# EAGLE design cc2652r_v2_rs (EAGLE 9.6.2)
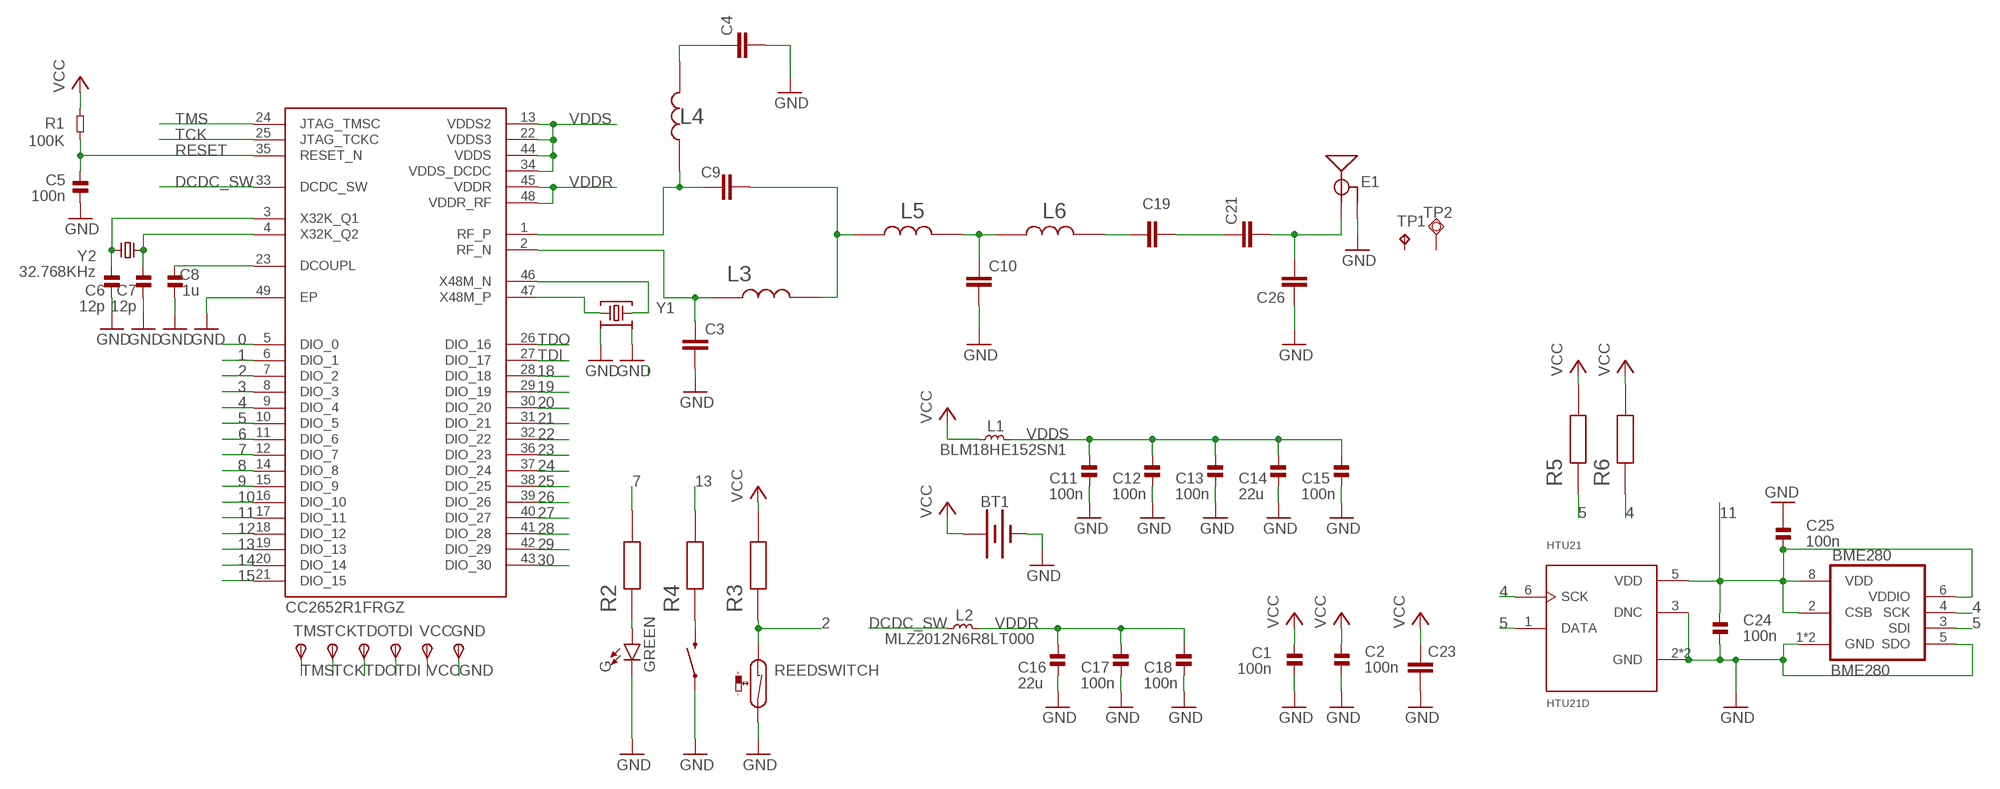
[diagram p0: schematic, sheet 1]

## Parts
BME280  BME280  [BME280]
BT1  BATTERY-20MM_SMD  [BATTCON_20MM]
C1  100n  CAP-0402  [_PKG_C_0402]
C2  100n  CAP-0402  [_PKG_C_0402]
C3  CAP0402  [CAPC1005X40N]
C4  12pF  CAP0402  [CAPC1005X40N]
C5  100n  CAP-0402  [_PKG_C_0402]
C6  12p  CAP-0402  [_PKG_C_0402]
C7  12p  CAP-0402  [_PKG_C_0402]
C8  1u  CAP-0402  [_PKG_C_0402]
C9  1pF  CAP0402  [CAPC1005X40N]
C10  1pF  CAP0402  [CAPC1005X40N]
C11  100n  CAP-0402  [_PKG_C_0402]
C12  100n  CAP-0402  [_PKG_C_0402]
C13  100n  CAP-0402  [_PKG_C_0402]
C14  22u  CAP-0805  [_PKG_C_0805]
C15  100n  CAP-0402  [_PKG_C_0402]
C16  22u  CAP-0805  [_PKG_C_0805]
C17  100n  CAP-0402  [_PKG_C_0402]
C18  100n  CAP-0402  [_PKG_C_0402]
C19  12pF  CAP0402  [CAPC1005X40N]
C21  1.8pF  CAP0402  [CAPC1005X40N]
C23  C_TANTALUM-2917(7343-METRIC)  [CAPM7343X310]
C24  100n  CAP-0402  [_PKG_C_0402]
C25  100n  CAP-0402  [_PKG_C_0402]
C26  CAP0402  [CAPC1005X40N]
E1  ANTENNA-GROUNDEDTRACE-15.2MM  [TRACE_ANTENNA_2.4GHZ_15.2MM]
G  GREEN  LED-GREEN0603  [LED-0603]
GND  TPSTP11R  [TP11R]
HTU21  HTU21D  [QFN100P300X300X100-7N]
IC3  CC2652R1FRGZ  CC2652R1FRGZT  [QFN50P700X700X100-49N]
L1  BLM18HE152SN1  INDUCTOR-0603  [_PKG_L_0603]
L2  MLZ2012N6R8LT000  INDUCTOR-0805  [_PKG_C_0805]
L3  2.4nH  IND0402IND0402  [INDC1005X40N]
L4  2.4nH  IND0402IND0402  [INDC1005X40N]
L5  2nH  IND0402IND0402  [INDC1005X40N]
L6  2nH  IND0402IND0402  [INDC1005X40N]
R1  100K  RES-0402  [_PKG_C_0402]
R2  2.2k  RES0402  [RESC1005X40N]
R3  510k  RES0402  [RESC1005X40N]
R4  100Ohm  RES0402  [RESC1005X40N]
R5  10k  RES0402  [RESC1005X40N]
R6  10k  RES0402  [RESC1005X40N]
REEDSWITCH  REED-SWITCH-MK6-5-B  [MK6-5]
SW1  MOMENTARY-SWITCH-SPST-SMD-4.6X2.8MM  [TACTILE_SWITCH_SMD_4.6X2.8MM]
TCK  TPSTP11R  [TP11R]
TDI  TPSTP11R  [TP11R]
TDO  TPSTP11R  [TP11R]
TMS  TPSTP11R  [TP11R]
TP1  TPTP06SQ  [TP05SQ]
TP2  TPSQTP15SQ  [TP15SQ]
VCC  TPSTP11R  [TP11R]
Y1  Q22FA12800150  48.000MHZ_CX2016DB48000C0FPLC1  [XTAL-4P-2016]
Y2  32.768KHz  32.768KHZ_Q13FC1350000400  [XTAL-2P-3215]

## Nets
0: IC3.5(DIO_0)
1: IC3.6(DIO_1)
2: IC3.7(DIO_2) R3.1 REEDSWITCH.1
3: IC3.8(DIO_3)
4: BME280.4(SCK) HTU21.6(SCK) IC3.9(DIO_4) R6.1
5: BME280.3(SDI) HTU21.1(DATA) IC3.10(DIO_5) R5.1
6: IC3.11(DIO_6)
7: IC3.12(DIO_7) R2.2
8: IC3.14(DIO_8)
9: IC3.15(DIO_9)
10: IC3.16(DIO_10)
11: BME280.2(CSB) BME280.6(VDDIO) BME280.8(VDD) C24.2 C25.1 HTU21.5(VDD) IC3.17(DIO_11)
12: IC3.18(DIO_12)
13: IC3.19(DIO_13) R4.2
14: IC3.20(DIO_14)
15: IC3.21(DIO_15)
18: IC3.28(DIO_18)
19: IC3.29(DIO_19)
20: IC3.30(DIO_20)
21: IC3.31(DIO_21)
22: IC3.32(DIO_22)
23: IC3.36(DIO_23)
24: IC3.37(DIO_24)
25: IC3.38(DIO_25)
26: IC3.39(DIO_26)
27: IC3.40(DIO_27)
28: IC3.41(DIO_28)
29: IC3.42(DIO_29)
30: IC3.43(DIO_30)
DCDC_SW: IC3.33(DCDC_SW) L2.1
DCOUPL: C8.2 IC3.23(DCOUPL)
GND: BME280.1(GND) BME280.5(SDO) BME280.7(GND) BT1.2(-) C1.1 C2.1 C3.2 C4.2 C5.1 C6.1 C7.1 C8.1 C10.2 C11.2 C12.2 C13.2 C14.2 C15.2 C16.2 C17.2 C18.2 C23.2 C24.1 C25.2 C26.1 E1.GND G.C GND.TP(PP) HTU21.2(GND) HTU21.3(DNC) HTU21.PAD(GND) IC3.49(EP) REEDSWITCH.2 SW1.1 SW1.2 Y1.2 Y1.4
N$1: C9.1 IC3.1(RF_P) L4.1
N$2: C3.1 IC3.2(RF_N) L3.1
N$3: C4.1 L4.2
N$4: C9.2 L3.2 L5.1
N$5: C19.1 L6.2
N$6: R4.1 SW1.3 SW1.4
N$7: C19.2 C21.1
N$9: C21.2 C26.2 E1.ANT(SIGNAL)
N$10: C10.1 L5.2 L6.1
N$11: G.A R2.1
RESET: C5.2 IC3.35(RESET_N) R1.1
TCK: IC3.25(JTAG_TCKC) TCK.TP(PP)
TDI: IC3.27(DIO_17) TDI.TP(PP)
TDO: IC3.26(DIO_16) TDO.TP(PP)
TMS: IC3.24(JTAG_TMSC) TMS.TP(PP)
VCC: BT1.1(+) C1.2 C2.2 C23.1 L1.1 R1.2 R3.2 R5.2 R6.2 VCC.TP(PP)
VDDR: C16.1 C17.1 C18.1 IC3.45(VDDR) IC3.48(VDDR_RF) L2.2
VDDS: C11.1 C12.1 C13.1 C14.1 C15.1 IC3.13(VDDS2) IC3.22(VDDS3) IC3.34(VDDS_DCDC) IC3.44(VDDS) L1.2
X32K_Q1: C6.2 IC3.3(X32K_Q1) Y2.1
X32K_Q2: C7.2 IC3.4(X32K_Q2) Y2.2
X48M_N: IC3.46(X48M_N) Y1.3
X48M_P: IC3.47(X48M_P) Y1.1
Unconnected: TP1.TP TP2.TP

## Library data of the parts
BME280 = bosch-bme280:BME280: DIGITAL HUMIDITY, PRESSURE AND TEMPERATURE SENSOR * Digital interface I²C (up to 3.4 MHz) and SPI (3 and 4 wire, up to 10 MHz)* Supply voltage VDD main supply voltage range: 1.71 V to 3.6 V*VDDIO interface voltage range: 1.2 V to 3.6 V Operating range -40…+85 °C, 0…100 % rel. humidity, 300…1100 hPa The library has been designed by Richard Magdycz <https://www.facebook.com/groups/eaglecadsoftUK>
BT1 = Batteries:BATTERY: Battery - Single Cell A variety of battery chemistries, sizes, and footprints. Device List: 20MM_PTH - Coin Cell Battery Holder - 20mm (PTH) <https://www.sparkfun.com/products/783> 6.8MM_PTH - Coin Cell Battery Holder - 6.8MM(SMD) <https://www.digikey.com/product-detail/en/seiko-instruments/MS621FE-FL11E/728-1057-ND/1889208?WT.srch=1&gclid=CNOQ5a6LzdQCFZS2wAodXCkE0g> 12MM_SMD - Coin Cell Battery Holder - 12mm (SMD) <https://www.sparkfun.com/products/10592> 12MM_PTH - Coin Cell Battery Holder - 12mm (PTH) <https://www.sparkfun.com/products/7948> 20MM_SMD - 20mm Coin Cell Battery Holder (SMD) (2 legs) Used on the Big Time Watch Kit <https://www.sparkfun.com/products/11734> 20MM_SMD_4LEGS - Coin Cell Battery Holder - 20mm (SMD) <https://www.sparkfun.com/products/11892> 20MM_SMD_4LEGS_OVERPASTE - Coin Cell Battery Holder - 20mm (SMD) <https://www.sparkfun.com/products/11892> (Over-paste on the legs) 24.5MM_PTH - Coin Cell Battery Holder - 24.5mm (PTH) <https://www.sparkfun.com/products/8863> 9V - 9V Battery Holder - PC Mount Used on the SparkFun SparkPunk Sound Kit <https://www.sparkfun.com/products/11177> and SparkFun SparkPunk Sequencer Kit <https://www.sparkfun.com/products/12707> 18650 - Battery Holder - 18650 (PTH) <https://www.sparkfun.com/products/13113> AA - Battery Holder - 1xAA (PTH) <https://www.sparkfun.com/products/7949> AAA - Battery Holder - 1xAAA (PTH) <https://www.sparkfun.com/products/12718> AA_KIT - Battery Holder - 1xAA (PTH) <https://www.sparkfun.com/products/7949> Special kit package - pads only have exposed copper on one side of the board. AAA_KIT - Battery Holder - 1xAAA (PTH) <https://www.sparkfun.com/products/12718> Special kit package - pads only have exposed copper on one side of the board.; PROD_ID: BATT-11519
C1 C2 C5-C8 C11-C18 C24 C25 = ok-discretes-dev:CAP
C3 C4 C9 C10 C19 C21 C26 = discretes-dev:CAP0402: CAP, 0402; AVAILABILITY: Good; DESCRIPTION: RESISTOR, 0402 0.063W 1% 3M6; Resistance:3.6Mohm; Resistance Tolerance:± 1%; Power Rating:0.063W; Voltage Rating:50V; Series:RC32H; Temperature Coefficient:± 100ppm/°C; Resistor Element Type:Thick Film; Resistor Case Style:0402; No. of Pins:2; SVHC:No SVHC; Case Style:0402; External Length / Height:1mm; Temperature Coeff. +:100ppm/°C; Temperature Coeff. -:100ppm/°C; External Depth:0.35mm; External Width:0.5mm; Operating Temperature Range:-55°C to +155°C; Overload Voltage:100V; MF: Yageo; MP: RC0402FR-073M6L; PACKAGE: 1005 Panasonic Electronic Components; PRICE: None; PURCHASE-URL: https://pricing.snapeda.com/search/part/RC0402FR-073M6L/?ref=eda
C23 = Capacitor:C: Capacitor - Generic; CATEGORY: Capacitor
E1 = SparkFun-RF:ANTENNA-GROUNDED: Antenna w/ Ground Connection 2.4GHz antennae with signal and ground terminals. TRACE_ANTENNA_2.4GHZ_15.2MM - Meander Trace antenna 15.2 x 5.7mm footprint Based on layout from TI app note AN043 <http://www.ti.com/lit/an/swra117d/swra117d.pdf>. TRACE_ANTENNA_2.4GHZ_25.7MM - Inverted F trace antenna 25.7 x 7.5 mm footprint. Based on layout from TI design note DN0007 <http://www.ti.com/lit/an/swru120b/swru120b.pdf>.
G = SparkFun-LED:LED-GREEN: Green SMD LED Used in manufacturing of various products at SparkFun Packages: 0603 - SMD 0603 package [Product Link] <http://www.futureelectronics.com/en/technologies/semiconductors/optoelectronics/leds/Pages/9894312-LTST-C190GKT.aspx?CrossPart=HSMG-C190&IM=0> LilyPad 1206 - SMD1206 LilyPad package [Product Link] <http://www.futureelectronics.com/en/Technologies/Product.aspx?ProductID=IN150NGHARVATEKCORPORATION2049943&IM=0> 1206 - SMD1206 package [Product Link] <http://www.futureelectronics.com/en/technologies/semiconductors/optoelectronics/leds/Pages/8315665-LTST-C150KGKT.aspx?IM=0> 1206 Bottom Mount -SMD 1206 Bottom Mount [Product Link] <http://www.digikey.com/product-detail/en/lite-on-inc/LTST-C230KGKT/160-1456-1-ND/386854> SparkFun Products: Pro Mini 328 -5V <https://www.sparkfun.com/products/821> RedBoard <https://www.sparkfun.com/products/12757> MP3 Trigger <https://www.sparkfun.com/products/13720> Makey Makey <https://www.sparkfun.com/products/11076>; PROD_ID: DIO-00821
GND TCK TDI TDO TMS VCC = testpad:TPS: TEST PIN
HTU21 = HTU21D:HTU21D: Digital Relative Humidity sensor with Temperature output Check prices <https://pricing.snapeda.com/parts/HTU21D/TE%20Connectivity/view-part?ref=eda>; AVAILABILITY: Warning; COMMENT: CAT-HSC0004; DESCRIPTION: Humidity Temperature Sensor 0 ~ 100% RH I²C ±2% RH 5s Surface Mount; MF: TE Connectivity; MP: HTU21D; PACKAGE: DFN-6 TE Connectivity; PRICE: None; PURCHASE-URL: https://pricing.snapeda.com/search/part/HTU21D/?ref=eda
IC3 = CC2652R1FRGZT:CC2652R1FRGZT: Texas Instruments SimpleLink? Multi-Standard CC2652R Wireless MCU 48-VQFN -40 to 85 Source: Datasheet <http://www.ti.com/lit/ds/symlink/cc2652r.pdf>; ARROW_PART_NUMBER: CC2652R1FRGZT; ARROW_PRICE-STOCK: https://www.arrow.com/en/products/cc2652r1frgzt/texas-instruments; DESCRIPTION: Texas Instruments SimpleLink? Multi-Standard CC2652R Wireless MCU 48-VQFN -40 to 85; HEIGHT: 1mm; MANUFACTURER_NAME: Texas Instruments; MANUFACTURER_PART_NUMBER: CC2652R1FRGZT; MOUSER_PART_NUMBER: 595-CC2652R1FRGZT; MOUSER_PRICE-STOCK: https://www.mouser.co.uk/ProductDetail/Texas-Instruments/CC2652R1FRGZT?qs=rrS6PyfT74ekj88w7n1zLw%3D%3D
L1 L2 = ok-discretes-dev:INDUCTOR
L3-L6 = discretes-dev:IND0402: RESISTOR, 0402 0.063W 1% 3M6; Resistance:3.6Mohm; Resistance Tolerance:± 1%; Power Rating:0.063W; Voltage Rating:50V; Series:RC32H; Temperature Coefficient:± 100ppm/°C; Resistor Element Type:Thick Film; Resistor Case Style:0402; No. of Pins:2; SVHC:No SVHC; Case Style:0402; External Length / Height:1mm; Temperature Coeff. +:100ppm/°C; Temperature Coeff. -:100ppm/°C; External Depth:0.35mm; External Width:0.5mm; Operating Temperature Range:-55°C to +155°C; Overload Voltage:100V Check prices <https://pricing.snapeda.com/parts/RC0402FR-073M6L/Yageo/view-part?ref=eda>; AVAILABILITY: Good; DESCRIPTION: RESISTOR, 0402 0.063W 1% 3M6; Resistance:3.6Mohm; Resistance Tolerance:± 1%; Power Rating:0.063W; Voltage Rating:50V; Series:RC32H; Temperature Coefficient:± 100ppm/°C; Resistor Element Type:Thick Film; Resistor Case Style:0402; No. of Pins:2; SVHC:No SVHC; Case Style:0402; External Length / Height:1mm; Temperature Coeff. +:100ppm/°C; Temperature Coeff. -:100ppm/°C; External Depth:0.35mm; External Width:0.5mm; Operating Temperature Range:-55°C to +155°C; Overload Voltage:100V; MF: Yageo; MP: RC0402FR-073M6L; PACKAGE: 1005 Panasonic Electronic Components; PRICE: None; PURCHASE-URL: https://pricing.snapeda.com/search/part/RC0402FR-073M6L/?ref=eda
R1 = ok-discretes-dev:RES
R2-R6 = discretes-dev:RES0402: RESISTOR, 0402 0.063W 1% 3M6; Resistance:3.6Mohm; Resistance Tolerance:± 1%; Power Rating:0.063W; Voltage Rating:50V; Series:RC32H; Temperature Coefficient:± 100ppm/°C; Resistor Element Type:Thick Film; Resistor Case Style:0402; No. of Pins:2; SVHC:No SVHC; Case Style:0402; External Length / Height:1mm; Temperature Coeff. +:100ppm/°C; Temperature Coeff. -:100ppm/°C; External Depth:0.35mm; External Width:0.5mm; Operating Temperature Range:-55°C to +155°C; Overload Voltage:100V Check prices <https://pricing.snapeda.com/parts/RC0402FR-073M6L/Yageo/view-part?ref=eda>; AVAILABILITY: Good; DESCRIPTION: RESISTOR, 0402 0.063W 1% 3M6; Resistance:3.6Mohm; Resistance Tolerance:± 1%; Power Rating:0.063W; Voltage Rating:50V; Series:RC32H; Temperature Coefficient:± 100ppm/°C; Resistor Element Type:Thick Film; Resistor Case Style:0402; No. of Pins:2; SVHC:No SVHC; Case Style:0402; External Length / Height:1mm; Temperature Coeff. +:100ppm/°C; Temperature Coeff. -:100ppm/°C; External Depth:0.35mm; External Width:0.5mm; Operating Temperature Range:-55°C to +155°C; Overload Voltage:100V; MF: Yageo; MP: RC0402FR-073M6L; PACKAGE: 1005 Panasonic Electronic Components; PRICE: None; PURCHASE-URL: https://pricing.snapeda.com/search/part/RC0402FR-073M6L/?ref=eda
REEDSWITCH = switch-reed:REED-SWITCH-: Reed Sensor; MF: MEDER; MPN: MK6-5-B; OC_FARNELL: 1079479
SW1 = SparkFun-Switches:MOMENTARY-SWITCH-SPST: Momentary Switch (Pushbutton) - SPST Normally-open (NO) SPST momentary switches (buttons, pushbuttons). Variants PTH-12MM - 12mm square, through-hole Momentary Pushbutton Switch - 12mm Square <https://www.sparkfun.com/products/9190> (COM-09190) PTH-6.0MM, PTH-6.0MM-KIT - 6.0mm square, through-hole Mini Pushbutton Switch <https://www.sparkfun.com/products/97> (COM-00097) KIT package intended for soldering kit's - only one side of pads' copper is exposed. PTH-RIGHT-ANGLE-KIT - Right-angle, through-hole Right Angle Tactile Button <https://www.sparkfun.com/products/10791> - Used on SparkFun BigTime Watch Kit <https://www.sparkfun.com/products/11734> SMD-12MM - 12mm square, surface-mount Tactile Button - SMD (12mm) <https://www.sparkfun.com/products/12993> (COM-12993) Used on SparkFun PicoBoard <https://www.sparkfun.com/products/11888> SMD-4.5MM - 4.5mm Square Trackball Switch Used on SparkFun Blackberry Trackballer Breakout <https://www.sparkfun.com/products/13169> SMD-4.6MMX2.8MM - 4.60mm x 2.80mm, surface mount Used on SparkFun SAMD21 Mini Breakout <https://www.sparkfun.com/products/13664> SMD-5.2MM, SMD-5.2-REDUNDANT - 5.2mm square, surface-mount Mini Pushbutton Switch - SMD <https://www.sparkfun.com/products/8720> (COM-08720) Used on Arduino Pro Mini <https://www.sparkfun.com/products/11114> REDUNDANT package connects both switch circuits together SMD-6.0X3.5MM - 6.0 x 3.5mm, surface mount Momentary Reset Switch SMD <https://www.sparkfun.com/products/8229> (COM-08229) SMD-6.2MM-TALL - 6.2mm square, surface mount Tactile Button - SMD (6mm) <https://www.sparkfun.com/products/12992> Used on SparkFun Digital Sandbox <https://www.sparkfun.com/products/12651> SMD-RIGHT-ANGLE - Right-angle, surface mount Used on SparkFun Block for Intel® Edison - Arduino <https://www.sparkfun.com/products/13036>; PROD_ID: SWCH-13065
TP1 = testpad:TP: Test pad
TP2 = testpad:TPSQ: Test pad
Y1 = ok-xtal-osc-dev:48.000MHZ_CX2016DB48000C0FPLC1: 48MHz ±10ppm Crystal 7pF 50 Ohms 4-SMD, No Lead Datasheet <https://media.digikey.com/pdf/Data%20Sheets/Kyocera%20International/CX2016DB48000C0FPLC1_DS.pdf>; DIGIKEY_PART: 1253-2042-1-ND; MFG_NAME: KYOCERA; MFG_PART: CX2016DB48000C0FPLC1
Y2 = ok-xtal-osc-dev:32.768KHZ_Q13FC1350000400: SMD Crystal Resonators 32.768KHz +/-20ppm SMD-3215_2P RoHS Datasheet <https://datasheet.lcsc.com/szlcsc/1901081604_Seiko-Epson-Q13FC1350000400_C32346.pdf>; LCSC_PART: C32346; MFG_NAME: SEIKO EPSON; MFG_PART: Q13FC1350000400

## Board
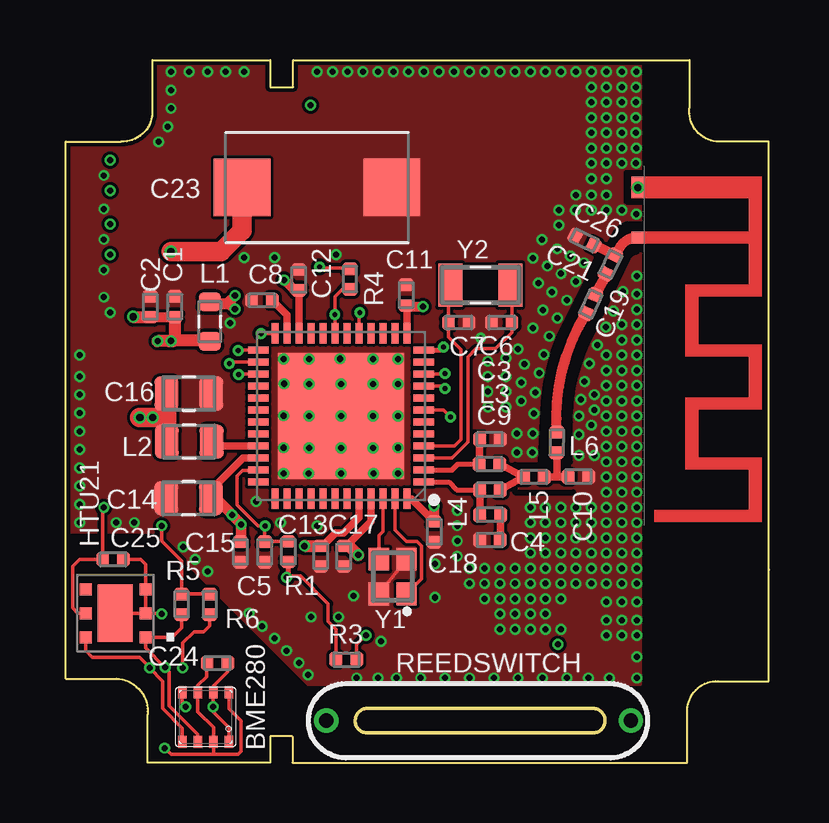
[diagram p1: board, top side]
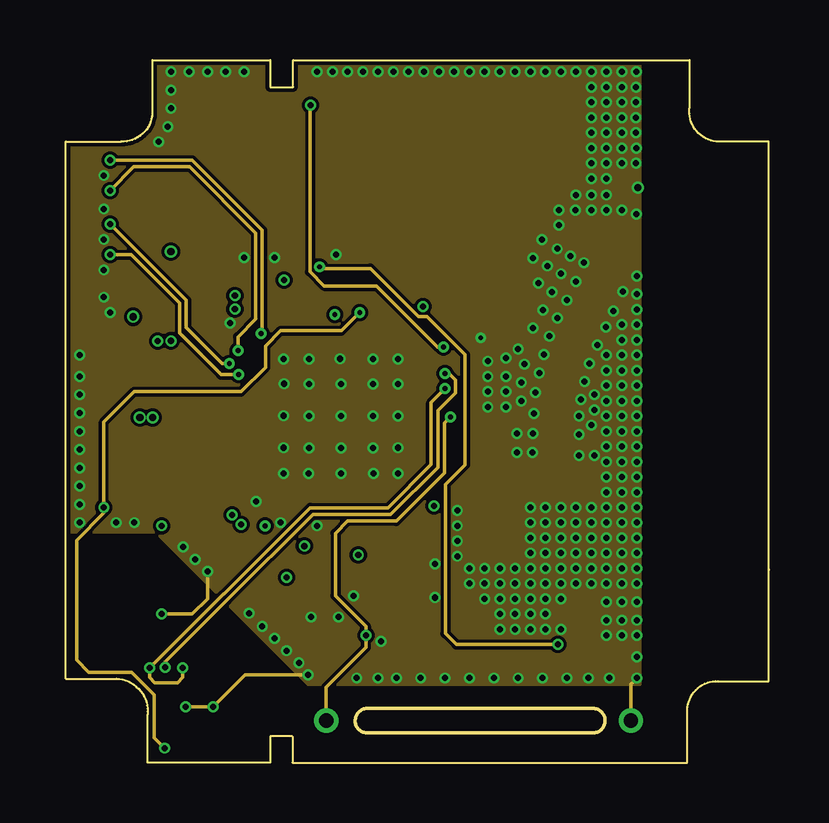
[diagram p2: board, inner layer Route2]
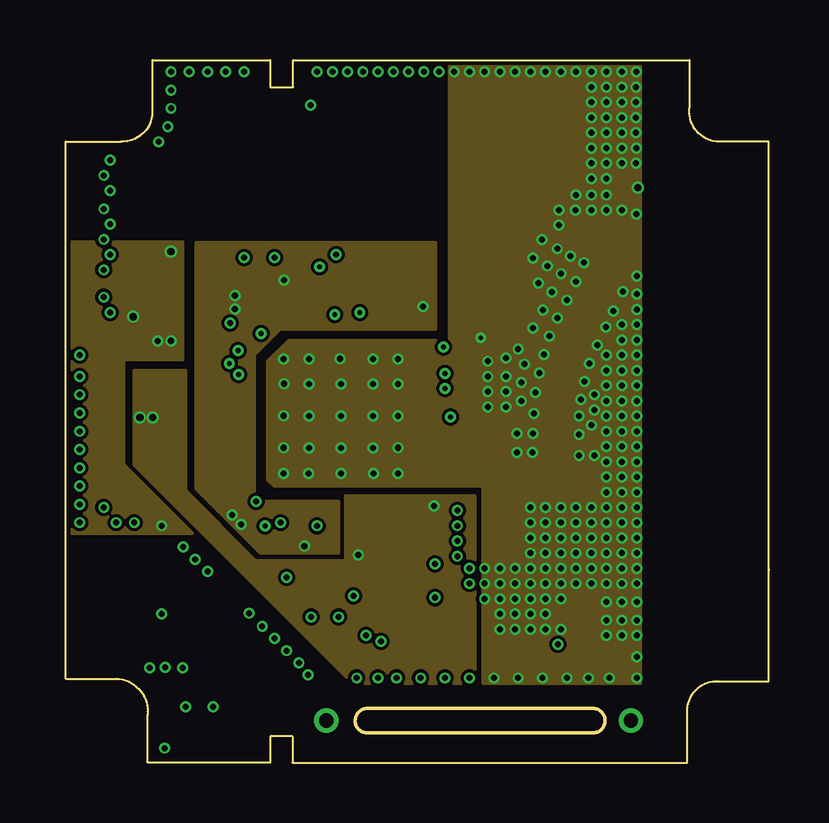
[diagram p3: board, inner layer Route15]
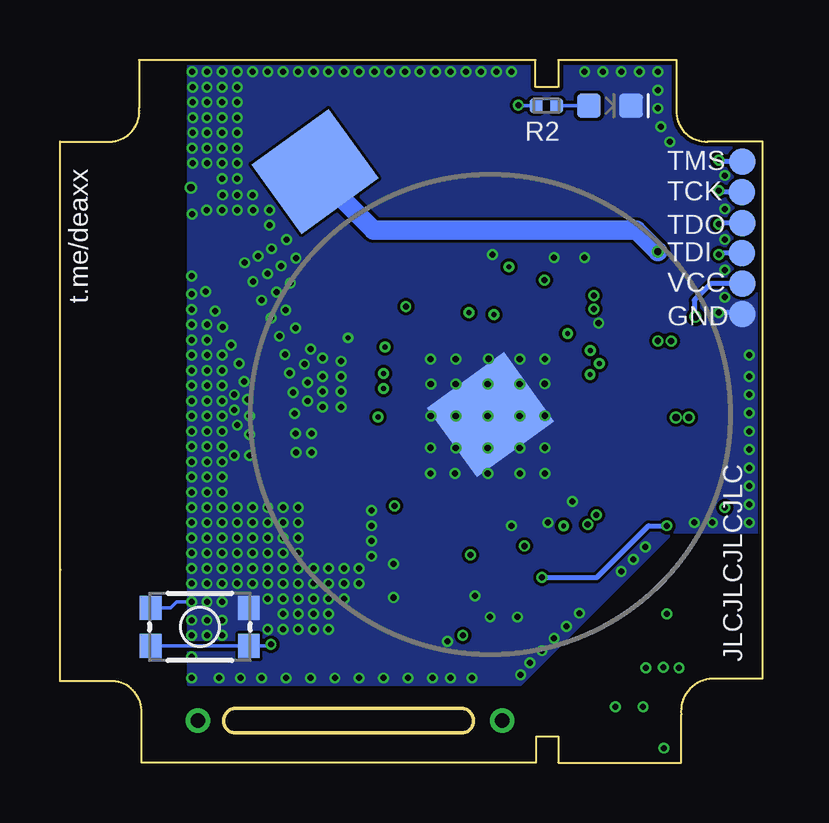
[diagram p4: board, bottom side, seen from below]

Size 29.3 x 29.3 mm. Coordinates in mm from the lower left corner, seen from the top.
Outline: 9.45,1.1 9.45,0 25.9,0 25.9,2.2 arc-90 27.2,3.4 29.3,3.4 29.3,8.07 29.3,8.01 29.3,22.34 29.3,22.4 29.3,25.9 27.1,25.9 arc-90 26,27.3 26,29.3 9.47,29.3 9.47,28.17 8.52,28.17 8.52,29.3 3.6,29.3 3.6,27.2 arc-95 2.3,25.9 0,25.9 0,3.5 2.1,3.5 arc-95 3.4,2 3.4,0 8.52,0 8.52,1.1 9.45,1.1
Outline: 12.51,2.26 22.03,2.26 arc-180 21.9,1.25 12.63,1.25 arc-180 12.51,2.26
Copper layers (1*2*15*16): Top 0.035559375mm / dielectric 0.17018125mm / Route2 0.01778125mm / dielectric 0.4mm / Route15 0.01778125mm / dielectric 0.17018125mm / Bottom 0.035559375mm
Design rules "oshpark-4layer *": minimum track width 6mil, minimum drill 0.2mm, track to track 5mil, track to pad 5mil, pad to pad 5mil, via to via 5mil, smd to smd 5mil, copper to edge 0.16mm, drill to drill 0.2mm, minimum pad ring 4mil, minimum via ring 4mil, stop-mask expansion 2.5mil, vias tented up to drill 50mil, thermal gap 10mil
tRestrict: area 16.6,19 to 18,20.8; 15 lines

### Footprints (pad centres in the part's own frame; a part is rotated, then mirrored left to right if it is on the bottom)
BME280 = smd 0.35 x 0.5: 1 0.975,-1.025; 2 0.325,-1.025; 3 -0.325,-1.025; 4 -0.975,-1.025; 5 -0.975,1.025; 6 -0.325,1.025; 7 0.325,1.025; 8 0.975,1.025
BATTCON_20MM = smd 3.56 x 3.96: 1 -12.5,0; 2 0,0
_PKG_C_0402 = smd 0.54 x 0.6: 1 -0.43,0; 2 0.43,0
CAPC1005X40N = smd 0.54 x 0.6: 1 -0.432,0; 2 0.432,0
_PKG_C_0805 = smd 1 x 1.42: 1 -0.935,0; 2 0.935,0
CAPM7343X310 = smd 2.368 x 2.404: 1 -3.121,0; 2 3.121,0
TRACE_ANTENNA_2.4GHZ_15.2MM = smd 0.5 x 0.5: ANT 0,-0.25 | smd 0.9 x 0.5: GND -2.1,-0.25
LED-0603 = smd 1 x 1: A -0.877,0; C 0.877,0
TP11R = smd 1.1 x 1.1: TP 0,0
QFN100P300X300X100-7N = smd 0.5 x 0.5: 1 -1.25,1; 2 -1.25,0; 3 -1.25,-1; 4 1.25,-1; 5 1.25,0; 6 1.25,1 | smd 1.45 x 2.4: PAD 0.013,0.002
QFN50P700X700X100-49N = smd 0.85 x 0.3: 1 -3.45,2.75; 2 -3.45,2.25; 3 -3.45,1.75; 4 -3.45,1.25; 5 -3.45,0.75; 6 -3.45,0.25; 7 -3.45,-0.25; 8 -3.45,-0.75; 9 -3.45,-1.25; 10 -3.45,-1.75; 11 -3.45,-2.25; 12 -3.45,-2.75; 25 3.45,-2.75; 26 3.45,-2.25; 27 3.45,-1.75; 28 3.45,-1.25; 29 3.45,-0.75; 30 3.45,-0.25; 31 3.45,0.25; 32 3.45,0.75; 33 3.45,1.25; 34 3.45,1.75; 35 3.45,2.25; 36 3.45,2.75 | smd 0.3 x 0.85: 13 -2.75,-3.45; 14 -2.25,-3.45; 15 -1.75,-3.45; 16 -1.25,-3.45; 17 -0.75,-3.45; 18 -0.25,-3.45; 19 0.25,-3.45; 20 0.75,-3.45; 21 1.25,-3.45; 22 1.75,-3.45; 23 2.25,-3.45; 24 2.75,-3.45; 37 2.75,3.45; 38 2.25,3.45; 39 1.75,3.45; 40 1.25,3.45; 41 0.75,3.45; 42 0.25,3.45; 43 -0.25,3.45; 44 -0.75,3.45; 45 -1.25,3.45; 46 -1.75,3.45; 47 -2.25,3.45; 48 -2.75,3.45 | smd 5.25 x 5.25: 49 0,0
_PKG_L_0603 = smd 0.79 x 0.93: 1 -0.82,0; 2 0.82,0
INDC1005X40N = smd 0.54 x 0.6: 1 -0.432,0; 2 0.432,0
RESC1005X40N = smd 0.54 x 0.6: 1 -0.432,0; 2 0.432,0
MK6-5 = drill 0.6 pad 1.016: 1 -6.35,0; 2 6.35,0
TACTILE_SWITCH_SMD_4.6X2.8MM = smd 0.9 x 1: 1 -2.05,-0.8; 2 2.05,-0.8; 3 2.05,0.8; 4 -2.05,0.8
TP05SQ = smd 0.5 x 0.5: TP 0,0
TP15SQ = smd 0.5 x 0.9: TP 0,0
XTAL-4P-2016 = smd 0.95 x 0.85: 1 -0.725,-0.575; 2 0.725,-0.575; 3 0.725,0.575; 4 -0.725,0.575
XTAL-2P-3215 = smd 1 x 1.8: 1 -1.25,0; 2 1.25,0

### Placement (x,y rotation side)
BME280  5.83,1.91 0 top
BT1  11.36,14.51 305.8 bottom
C1  4.54,19.01 270 top
C2  3.51,19.01 270 top
C3  17.68,13.49 0 top
C4  17.68,9.3 180 top
C5  8.29,8.79 90 top
C6  18.17,18.35 0 top
C7  16.38,18.35 180 top
C8  8.18,19.28 0 top
C9  17.68,11.38 0 top
C10  21.37,11.93 0 top
C11  14.18,19.5 90 top
C12  9.71,20.13 90 top
C13  10.63,8.61 270 top
C14  5.11,11.02 180 top
C15  7.27,8.79 270 top
C16  5.13,15.39 0 top
C17  11.59,8.61 270 top
C18  15.35,9.63 270 top
C19  21.88,19.13 65.3 top
C21  22.7,20.77 63.8 top
C23  10.47,23.98 0 top
C24  6.32,4.15 180 top
C25  1.97,8.48 0 top
C26  21.61,21.77 333.4 top
E1  24.09,21.89 270 top
G  6.37,27.39 0 bottom
GND  0.85,18.71 0 bottom
HTU21  2.07,6.24 180 top
IC3  11.46,14.45 180 top
L1  6,18.39 90 top
L2  5.14,13.39 180 top
L3  17.66,12.45 0 top
L4  17.69,10.34 0 top
L5  19.52,11.91 0 top
L6  20.46,13.35 89.4 top
R1  9.27,8.8 270 top
R2  9.02,27.4 180 bottom
R3  11.69,4.31 180 top
R4  11.85,20.17 270 top
R5  4.82,6.61 90 top
R6  5.99,6.61 90 top
REEDSWITCH  17.21,1.75 0 top
SW1  23.47,5.67 180 bottom
TCK  0.87,23.79 0 bottom
TDI  0.88,21.26 0 bottom
TDO  0.85,22.49 0 bottom
TMS  0.86,25.06 0 bottom
TP1  23.84,21.89 0 top
TP2  23.84,23.99 0 top
VCC  0.85,19.97 0 bottom
Y1  13.62,7.76 90 top
Y2  17.28,19.91 180 top

### Tracks (layer width: path | path; a pad name or v marks a point on that pad's centre or on a via)
2  (via drill 0.2 pad 0.45, 0.25)
  Top 0.152: IC3.7 15.75,14.7 v16.04,14.42 | R3.1 12.13,4.93 v12.51,5.31
  Route2 0.152: v16.04,14.42 15.78,14.16 15.78,12.08 13.78,10.07 11.74,10.07 11.24,9.56 11.24,6.96 12.51,5.69 v12.51,5.31 12.51,4.8 10.86,3.15 REEDSWITCH.1
4  (via drill 0.2 pad 0.45, 0.25)
  Top 0.152: HTU21.6 0.82,4.68 1.1,4.4 3.08,4.4 3.49,3.99 v3.49,3.95 4.04,3.4 4.04,2.26 4.85,1.44 BME280.4 | IC3.9 15.7,15.7 v15.81,15.6 | R6.1 5.99,5.72 5.74,5.46 5.35,5.46 4.87,4.99 v4.87,3.95
  Route2 0.152: v15.81,15.6 15.22,15.01 15.22,12.43 13.42,10.63 10.18,10.63 6.59,7.04 6.58,7.04 v3.49,3.95 3.49,3.56 3.71,3.34 4.66,3.34 4.87,3.56 v4.87,3.95
5  (via drill 0.2 pad 0.45, 0.25)
  Top 0.152: BME280.3 5.5,1.19 4.31,2.38 4.31,3.8 v4.14,3.98 v4.12,3.98 3.32,4.78 HTU21.1 4.43,5.24 4.82,5.63 R5.1 | IC3.10 15.78,16.2 v15.81,16.23
  Route2 0.152: v4.14,3.98 4.14,4.2 6.69,6.76 6.7,6.76 10.3,10.35 13.54,10.35 15.5,12.32 15.5,14.68 16.24,15.42 16.24,15.97 15.97,16.23 v15.81,16.23
7  (via drill 0.2 pad 0.45, 0.25)
  Top 0.2: IC3.12 15.61,17.2 v15.75,17.34
  Route2 0.152: v10.2,27.41 10.17,27.38 10.17,20.47 10.77,19.88 12.95,19.88 15.49,17.34 v15.75,17.34
  Bottom 0.152: v10.2,27.41 v10.19,27.4 R2.2
11  (via drill 0.2 pad 0.45, 0.25)
  Top 0.152: 6.82,2.95 BME280.8 6.8,2.25 7.3,1.75 7.3,0.48 7.17,0.36 6.16,0.36 | HTU21.5 0.49,6.24 0.27,6.45 0.27,8.19 0.57,8.48 C25.1 1.54,10.64 v1.58,10.64 | C24.2 5.87,4.13 5.87,3.59 5.5,3.22 BME280.6 5.5,2.13 6.15,1.48 BME280.2 6.16,0.36 | v4.12,0.61 4.38,0.36 6.16,0.36 | IC3.17 12.22,18.73 v12.25,18.77
  Route2 0.152: v4.12,0.61 3.69,1.05 3.69,2.83 2.74,3.78 0.96,3.78 0.44,4.29 0.44,9.27 1.58,10.42 v1.58,10.64 1.58,14.2 2.85,15.47 7.3,15.47 8.32,16.49 8.32,17.37 8.95,18.01 11.49,18.01 v12.25,18.77
13  (via drill 0.2 pad 0.45)
  Top 0.152: IC3.19 v11.22,18.68 v11.21,18.68 | v11.21,18.68 | v11.21,18.68 11.21,19.44 11.5,19.74 R4.2
24
  Top 0.152: IC3.37 8.61,10.9
DCDC_SW
  Top 0.305: IC3.33 6.26,13.2 L2.1
DCOUPL
  Top 0.305: IC3.23 9.22,18.67 C8.2
GND  (via drill 0.2 pad 0.45, 0.25, 0.25 pad 0.46, 0.3)
  Top 0.152: Y1.4 Y1.2 | BME280.1 6.8,1.46 6.14,2.12 v6.14,2.33 BME280.7 6.16,2.94 6.16,3.21 6.75,3.8 C24.1 | 2.08,6.24 HTU21.PAD HTU21.2 | v4.99,2.33 4.85,2.46 BME280.5 | HTU21.2 3.96,6.24 v4,6.2 | HTU21.2 HTU21.3 3.32,8.28 3.11,8.48 C25.2
  Top 0.305: v23.84,23.98 E1.GND
  Route2 0.152: v5.9,7.98 5.9,6.83 5.27,6.2 v4,6.2 | v10.09,3.66 7.48,3.66 v6.14,2.33 v4.99,2.33 | REEDSWITCH.2 23.56,3.28 v23.81,3.53
  Bottom 0.152: SW1.2 24.69,6.47 24.44,6.71 v23.81,6.71
  Bottom 0.2: GND.TP 0.92,18.77 v1.84,18.77
  other vias: 12.8,15.79 11.46,14.45 10.13,15.79 11.46,15.79 12.8,14.45 12.8,13.12 11.46,13.12 10.13,13.12 10.13,14.45 17.29,17.72 6.84,18.33 15.39,8.28 11.26,21.18 10.13,16.83 11.43,16.84 12.8,16.83 10.12,12.07 11.46,12.07 12.82,12.07 9.08,16.83 9.09,15.8 9.08,14.47 9.08,13.13 9.08,12.07 13.85,12.07 13.85,13.13 13.84,14.45 13.84,15.79 13.85,16.83 23.77,28.16 23.81,19.53 23.81,18.9 23.81,18.26 23.81,17.63 23.81,16.99 23.81,16.36 23.81,15.72 23.81,15.09 23.81,14.45 23.81,13.82 23.81,13.18 23.81,12.55 23.81,11.91 23.81,11.28 23.81,10.64 23.81,10.01 23.81,9.37 23.81,8.74 23.81,8.1 23.81,7.47 23.17,7.47 22.54,7.47 21.9,7.47 21.27,7.47 20.63,7.47 20,7.47 23.81,20.3 23.78,28.8 23.77,27.55 23.76,26.9 23.76,26.26 23.78,25.63 23.77,24.99 23.17,28.8 22.54,28.8 21.9,28.8 21.9,28.17 21.9,27.53 21.9,26.9 21.9,26.26 21.9,25.63 21.9,24.99 21.9,24.36 18.86,17.25 18.35,16.87 17.59,16.74 17.59,16.1 17.59,15.47 17.59,14.83 18.35,14.83 18.09,7.47 17.46,7.47 17.46,8.1 16.82,8.1 16.32,8.61 16.32,9.25 16.32,9.88 16.32,10.52 18.73,7.47 19.36,7.47 19.36,10.64 19.36,10.01 19.36,9.37 19.36,8.74 19.36,8.1 23.17,24.99 22.54,24.99 22.53,23.67 20,10.64 20.63,10.64 21.27,10.64 21.9,10.64 22.54,10.64 23.17,10.64 23.17,10.01 23.17,9.37 23.17,8.74 23.17,8.1 22.54,11.28 22.54,11.91 22.54,12.55 18.73,8.1 18.09,8.1 22.54,24.36 23.78,22.87 21.27,28.8 20.63,28.8 20,28.8 19.36,28.8 18.73,28.8 18.09,28.8 17.46,28.8 16.82,28.8 16.19,28.8 15.55,28.8 14.92,28.8 14.28,28.8 13.65,28.8 13.01,28.8 12.38,28.8 11.74,28.8 11.11,28.8 10.47,28.8 7.43,28.8 6.66,28.8 5.9,28.8 5.14,28.8 4.38,28.8 4.38,28.04 4.38,27.28 4.25,26.52 3.87,25.88 9.71,4.17 9.2,4.67 8.7,5.18 8.19,5.69 5.39,8.48 4.89,8.99 0.57,10.01 2.09,10.01 2.85,10.01 0.57,10.77 0.57,11.53 0.57,12.29 0.57,13.06 0.57,13.82 0.57,14.58 0.57,15.34 0.57,16.1 0.57,16.99 20,10.01 20.63,10.01 21.27,10.01 21.9,10.01 22.54,10.01 20,9.37 20,8.74 20,8.1 20.63,8.1 21.27,8.1 21.9,8.1 22.54,8.1 22.67,3.53 21.78,3.53 20.89,3.53 19.87,3.53 18.86,3.53 17.84,3.53 16.82,3.53 15.81,3.53 14.79,3.53 13.78,3.53 13.01,3.53 7.64,6.24 21.9,23.67 23.17,11.28 22.54,28.17 23.17,28.17 23.17,27.53 23.17,26.9 23.17,26.26 23.17,25.63 23.81,5.94 23.81,5.31 23.17,5.94 23.17,5.31 22.54,5.94 22.54,5.31 23.81,4.42 17.46,6.83 18.09,6.83 18.73,6.83 19.36,6.83 20,6.83 16.82,7.47 22.54,6.71 23.17,6.71 20.63,6.83 21.9,23.04 22.54,23.04 22.03,12.8 21.4,12.8 21.4,13.69 21.4,14.45 21.47,15.14 21.62,15.89 21.83,16.65 22.16,17.41 22.51,18.16 22.83,18.84 23.23,19.65 19.45,12.93 18.81,12.93 19.48,13.73 19.52,14.56 19.58,15.43 19.73,16.24 19.92,17.02 20.15,17.78 20.49,18.54 20.89,19.28 21.26,20.05 21.6,20.84 21.04,21.12 20.48,21.43 20.56,22.42 20.56,23.04 21.24,23.04 20.65,20.38 20.27,19.62 19.88,18.87 19.48,18.12 18.81,13.73 20.08,20.71 19.69,19.99 23.19,23.04 13.14,5.06 1.58,24.49 1.58,23.09 1.58,21.82 1.58,20.55 1.58,19.41 12,6.96 11.36,6.07 10.22,6.07 7.43,21.06 8.7,21.06 15.39,6.88 12.13,3.53 23.17,11.91 23.17,12.55 23.17,13.18 23.17,13.82 23.17,14.45 23.17,15.09 23.17,15.72 23.17,16.36 23.17,16.99 23.17,17.63 23.17,18.26 22.54,13.18 22.54,13.82 22.54,14.45 22.54,15.09 22.54,15.72 22.54,16.36 22.54,16.99 22.54,25.63 22.54,26.26 22.54,26.9 22.54,27.53 20.63,9.37 20.63,8.74 21.27,8.74 21.9,8.74 22.54,8.74 22.54,9.37 21.9,9.37 21.27,9.37 7.93,10.9 8.95,10.01 10.47,9.88 18.35,15.47 18.35,16.1 18.98,15.85 19.11,16.61 18.98,15.09 21.9,14.07 22.03,14.71 22.03,15.34 18.09,6.2 18.09,5.56 18.73,6.2 19.36,6.2 20,6.2 18.73,5.56 19.36,5.56 20,5.56 20.63,5.56 21.27,23.67 19.47,21.04 19.85,21.81
  pour Route15: 8.42,16.74 8.42,11.79 8.67,11.53 17.38,11.53 17.38,3.32 23.95,3.32 23.95,29.58 16,29.58 16,17.6 9.28,17.6
  pour Top (no thermals): -0.19,9.63 3.74,9.63 10.09,3.28 23.95,3.28 23.95,29.49 -0.19,29.49
  pour Bottom (no thermals): -0.32,9.63 -0.32,29.57 23.94,29.57 23.94,3.28 10.09,3.28 3.74,9.63
  pour Route2: -0.19,29.44 23.94,29.44 23.94,3.28 10.09,3.28 3.74,9.63 -0.19,9.63
N$1
  Top 0.203: IC3.1 15.97,11.7 16.29,11.38 C9.1
  Top 0.305: C9.1 17.26,11.37 L4.1
N$2
  Top 0.203: IC3.2 16.1,12.2 16.34,12.45 L3.1
  Top 0.305: L3.1 17.23,12.57 | 17.27,12.49 L3.1 | C3.1 17.24,12.46 L3.1
N$3
  Top 0.305: L4.2 18.12,9.31 C4.1
N$4
  Top 0.305: L3.2 L5.1 C9.2
N$5
  Top 0.406: L6.2 20.46,14.35 arc-32 C19.1
N$6  (via drill 0.2 pad 0.45, 0.25)
  Top 0.152: R4.1 11.82,20.63 10.63,20.63 v10.58,20.68
  Route2 0.152: v10.58,20.68 10.58,20.61 12.7,20.61 14.45,18.86 14.45,18.85 14.7,18.6 15.06,18.6 16.64,17.01 16.64,12.42 15.82,11.6 15.82,5.39 16.28,4.93 v20.51,4.93
  Bottom 0.152: SW1.3 SW1.4 20.57,4.87 v20.51,4.93
N$7
  Top 0.406: C19.2 22.51,20.32 C21.1
N$9
  Top 0.406: E1.ANT arc62 23.13,21.54 C21.2 22.02,21.58 C26.2
N$10
  Top 0.305: L5.2 19.96,11.9 | L5.2 19.96,11.9 | L5.2 19.91,11.95 | L5.2 20.47,11.91 | 20.47,11.91 20.93,11.91 C10.1 | L6.1 20.47,12.9 20.47,11.91
N$11
  Bottom 0.152: G.A 8.58,27.39 R2.1
RESET  (via drill 0.2 pad 0.45)
  Top 0.152: R1.1 C5.2 8.29,9.83 8.3,9.84 v8.3,9.87 8.02,9.87 7.14,10.75 7.14,11.96 7.36,12.18 8,12.18 IC3.35
TCK  (via drill 0.2 pad 0.45, 0.25)
  Top 0.152: IC3.25 7.2,17.2 v7.19,17.18
  Route2 0.152: v1.84,23.85 2.83,24.84 5.15,24.84 7.91,22.08 7.91,18.49 7.17,17.76 7.17,17.2 v7.19,17.18
  Bottom 0.2: TCK.TP 1.78,23.79 v1.84,23.85
TDI  (via drill 0.2 pad 0.45, 0.25)
  Top 0.152: IC3.27 7.22,16.2 v7.2,16.18
  Route2 0.152: v1.84,21.18 2.71,21.18 4.73,19.16 4.73,17.91 6.46,16.18 v7.2,16.18
  Bottom 0.152: TDI.TP
  Bottom 0.2: TDI.TP 1.77,21.25 v1.84,21.18
TDO  (via drill 0.2 pad 0.45, 0.25)
  Top 0.152: IC3.26 8,16.72 6.9,16.72 v6.82,16.64
  Route2 0.152: v1.84,22.45 5.01,19.28 5.01,18.14 6.51,16.64 v6.82,16.64
  Bottom 0.152: 0.81,22.49 TDO.TP
  Bottom 0.2: TDO.TP 1.8,22.49 v1.84,22.45
TMS  (via drill 0.2 pad 0.45, 0.25)
  Top 0.152: IC3.24 8.15,17.9 v8.14,17.9
  Route2 0.152: v1.84,25.12 5.27,25.12 8.19,22.2 8.19,17.95 v8.14,17.9
  Bottom 0.2: TMS.TP 1.78,25.06 v1.84,25.12
VCC  (via drill 0.25, 0.25 pad 0.46, 0.3)
  Top 0.152: R6.2 R5.2 4.82,8.42 4,9.25 v4,9.88 | 11.24,4.33 R3.2 11.26,5.57 10.93,5.89 10.93,6.63 9.78,7.79 9.27,7.79
  Top 0.203: R1.2 9.27,7.79 v9.2,7.72
  Top 0.406: C2.2 C1.2 | 4.54,17.65 4.47,17.58 | v4.38,17.59 4.31,17.59 4.3,17.58
  Top 0.508: L1.1 5.98,17.6 v4.38,17.6 v4.38,17.59 | 4.47,17.58 4.3,17.58 v3.82,17.58 | C1.2 4.54,17.65 | C2.2 3.5,18.57 2.83,18.57 v2.8,18.59
  Top 0.813: v4.38,21.31 6.46,21.31 7.35,22.2 C23.1
  Route2 0.152: v9.2,7.72 9.19,7.74
  Bottom 0.2: VCC.TP 2.17,19.97 2.85,19.28 2.85,18.64 v2.8,18.59
  Bottom 0.203: v9.2,7.72 6.92,7.72 4.76,9.88 v4,9.88
  Bottom 0.813: BT1.1 16.22,22.2 5.27,22.2 v4.38,21.31
  pour Route15: 4.86,21.71 4.86,16.8 2.41,16.8 2.41,12.43 5.29,9.55 0.25,9.55 0.25,21.71
VDDR  (via drill 0.25, 0.25 pad 0.46, 0.3)
  Top 0.305: IC3.45 12.72,10.06 11.69,9.04 C17.1 11.81,9.04 | IC3.48 14.41,11 C18.1
  Top 0.406: v15.35,10.71 C18.1
  Top 0.508: 11.81,9.04 v12.19,8.66
  Top 0.813: C16.1 4.21,15.38 4.21,14.39 | L2.2 4.21,14.39 | 4.21,14.39 v3.08,14.39
  other vias: 3.62,14.39
  pour Route15: 11.66,11.11 11.66,8.42 7.91,8.42 4.99,11.34 4.99,16.36 2.84,16.36 2.84,12.41 11.95,3.3 17.05,3.3 17.05,11.11
VDDS  (via drill 0.25, 0.25 pad 0.45, 0.25 pad 0.46)
  Top 0.152: 6.15,19.06 L1.2
  Top 0.254: 6.05,11.38 C14.1
  Top 0.305: L1.2 6.77,19.21 | IC3.34 7.38,12.7 6.05,11.38 | C14.1 6.27,11.02 | 7.3,9.24 C15.1 | IC3.44 12.22,10.23 11.58,9.59 11.25,9.59 10.7,9.04 C13.1 | v9.94,9.03 v9.95,9.04 | IC3.13 14.22,19.03 C11.1 | IC3.22 C12.1
  Top 0.33: 6.89,19.06 6.15,19.06
  Top 0.406: v7.05,19.48 6.77,19.21 | v7.05,18.91 6.89,19.06 | C11.1 14.22,19.03 v14.88,19.03 | C12.1 9.53,19.7 9.12,20.12 v9.1,20.12
  Top 0.432: 6.27,11.02 6.93,10.36 v6.93,10.33 7.3,9.96 v7.3,9.93 7.3,9.24
  Top 0.508: v9.95,9.04 C13.1
  pour Route15: 11.36,8.74 8.1,8.74 5.43,11.41 5.43,21.69 15.41,21.69 15.41,18.07 8.92,18.07 7.85,16.99 7.85,10.9 11.36,10.9
X32K_Q1
  Top 0.152: 15.21,12.7 IC3.3 16.09,12.7 16.76,13.37 16.76,16.92 17.1,17.26 17.92,17.26 18.6,17.94 C6.2 18.6,19.85 Y2.1
X32K_Q2
  Top 0.152: IC3.4 14.93,13.22 16.21,13.22 16.48,13.49 16.48,17.22 15.95,17.76 C7.2 15.95,19.83 Y2.2
X48M_N
  Top 0.152: 13.19,10.98 IC3.46 13.22,9.65 13.05,9.48 Y1.3
X48M_P
  Top 0.152: Y1.1 14.83,7.66 14.83,9.04 14.64,9.23 14.21,9.23 13.73,9.72 13.73,10.99 IC3.47

### Text on the board
tNames: .
bNames: TMS | TCK | TDO | TDI | VCC | t.me/deaxx | GND | JLCJLCJLCJLC